# EasyEDA Pro project ProPrj_Keyboard_2025-12-19.epro

# Schematic Schematic1
Board Name: Board1; Create Date: 2025-12-10; Page Name: P1; Project Name: Keyboard; Schematic Name: Schematic1; Update Date: 2025-12-17; Company: BluePrint; Drawn: Saymon Islam; Page Size: A4; Version: V1.0
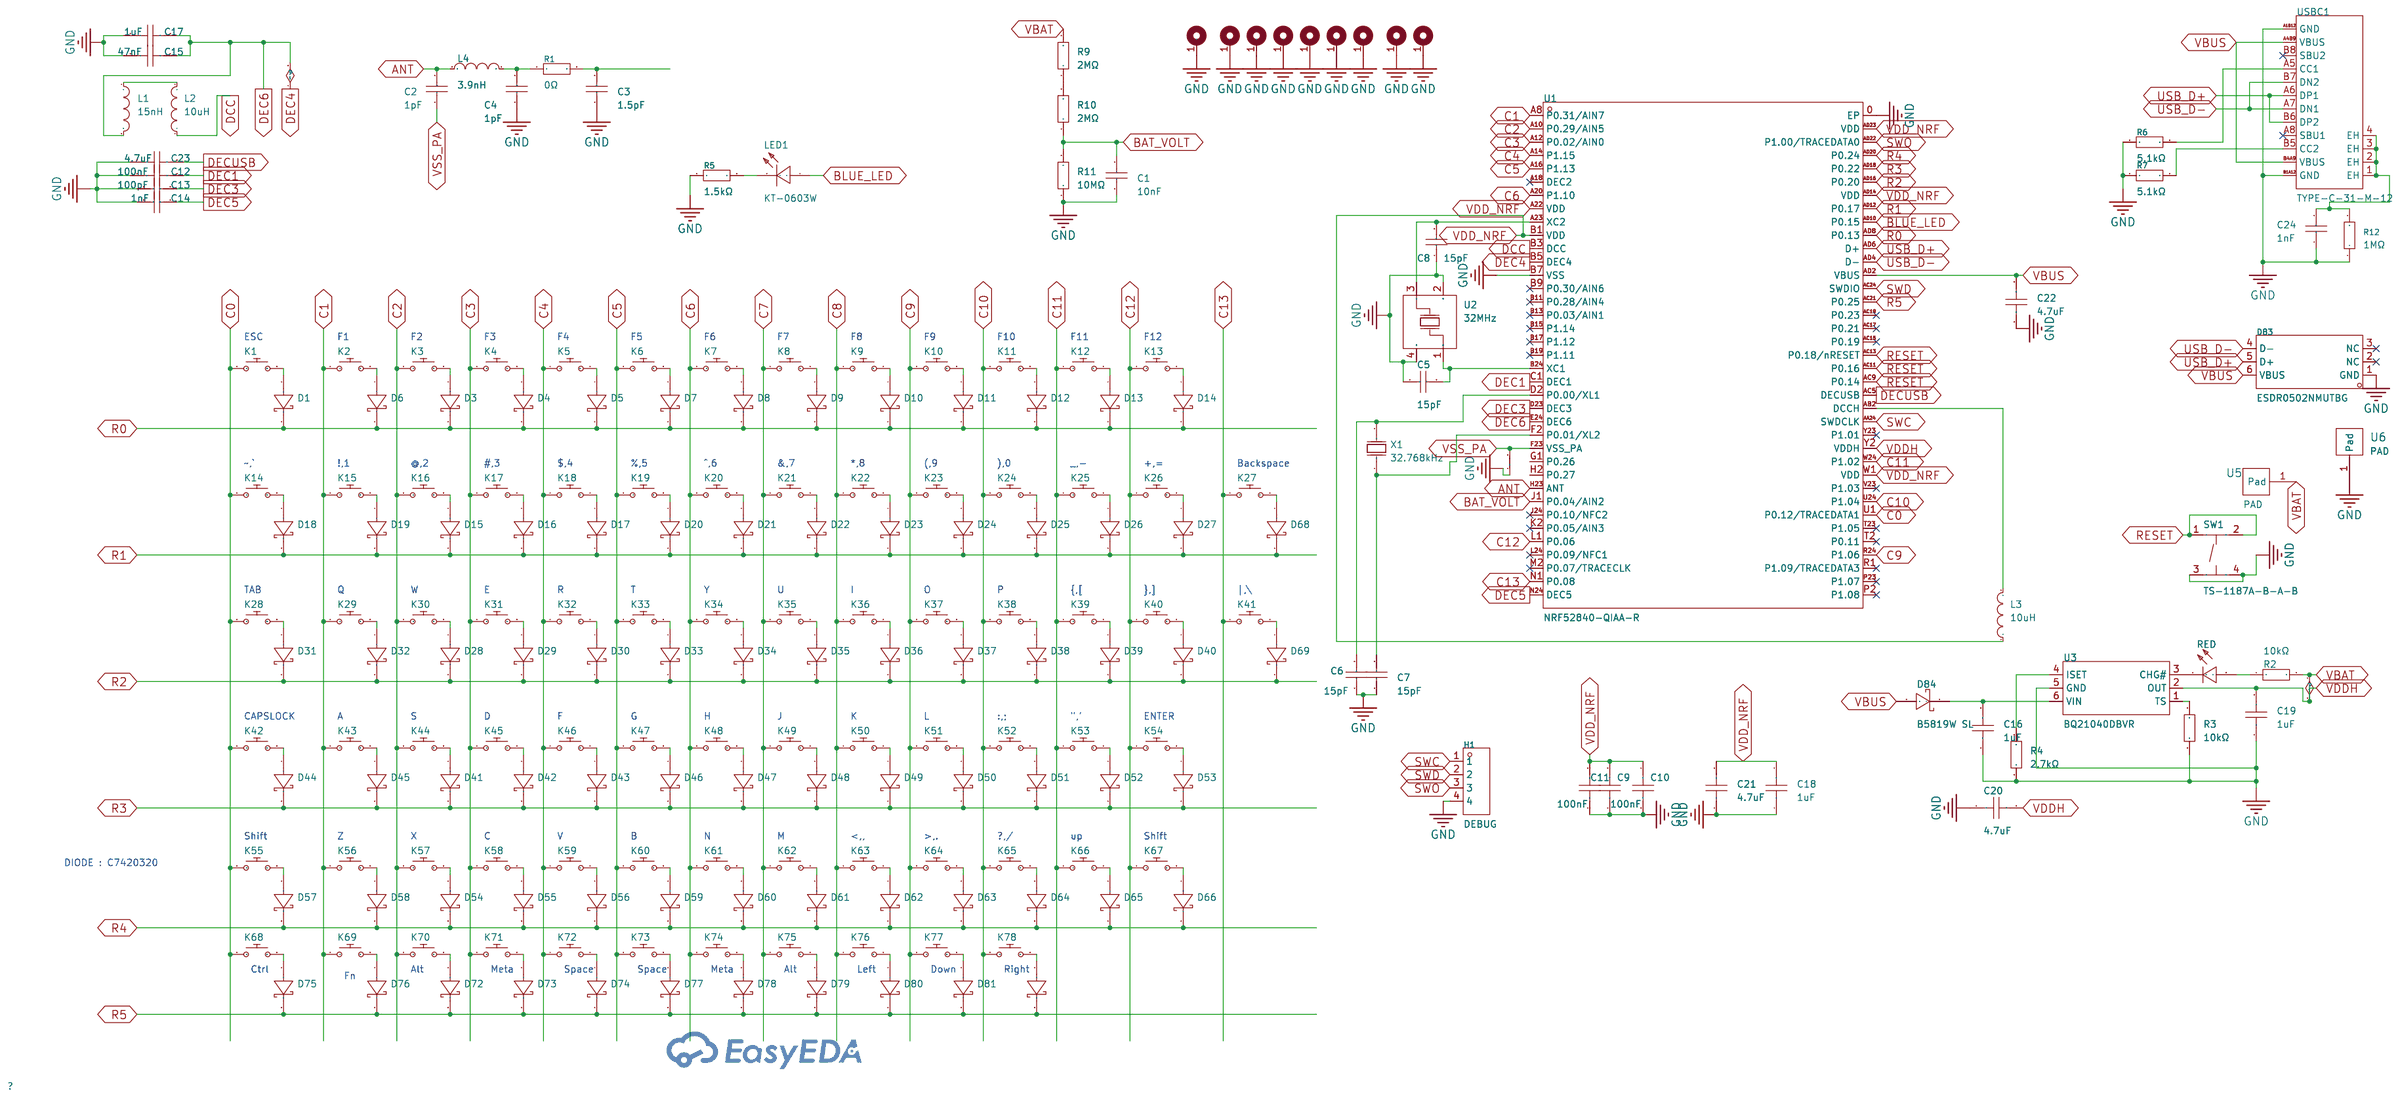
[diagram p0: schematic sheet]

## Parts
C1  10nF  [C0402]
C2  1pF  [C0402]
C3  1.5pF  [C0402]
C4  1pF  [C0402]
C5  15pF  [C0402]
C6  15pF  [C0402]
C7  15pF  [C0402]
C8  15pF  [C0402]
C9  100nF  [C0402]
C10  100nF  [C0402]
C11  100nF  [C0402]
C12  100nF  [C0402]
C13  100pF  [C0402]
C14  1nF  [C0402]
C15  47nF  [C0402]
C16  1uF  [C0402]
C17  1uF  [C0402]
C18  1uF  [C0402]
C19  1uF  [C0402]
C20  4.7uF  [C0402]
C21  4.7uF  [C0402]
C22  4.7uF  [C0402]
C23  4.7uF  [C0402]
C24  1nF  [C0402]
D1  1N4148WT  [SOD-523_L1.2-W0.8-LS1.6-FD]
D3  1N4148WT  [SOD-523_L1.2-W0.8-LS1.6-FD]
D4  1N4148WT  [SOD-523_L1.2-W0.8-LS1.6-FD]
D5  1N4148WT  [SOD-523_L1.2-W0.8-LS1.6-FD]
D6  1N4148WT  [SOD-523_L1.2-W0.8-LS1.6-FD]
D7  1N4148WT  [SOD-523_L1.2-W0.8-LS1.6-FD]
D8  1N4148WT  [SOD-523_L1.2-W0.8-LS1.6-FD]
D9  1N4148WT  [SOD-523_L1.2-W0.8-LS1.6-FD]
D10  1N4148WT  [SOD-523_L1.2-W0.8-LS1.6-FD]
D11  1N4148WT  [SOD-523_L1.2-W0.8-LS1.6-FD]
D12  1N4148WT  [SOD-523_L1.2-W0.8-LS1.6-FD]
D13  1N4148WT  [SOD-523_L1.2-W0.8-LS1.6-FD]
D14  1N4148WT  [SOD-523_L1.2-W0.8-LS1.6-FD]
D15  1N4148WT  [SOD-523_L1.2-W0.8-LS1.6-FD]
D16  1N4148WT  [SOD-523_L1.2-W0.8-LS1.6-FD]
D17  1N4148WT  [SOD-523_L1.2-W0.8-LS1.6-FD]
D18  1N4148WT  [SOD-523_L1.2-W0.8-LS1.6-FD]
D19  1N4148WT  [SOD-523_L1.2-W0.8-LS1.6-FD]
D20  1N4148WT  [SOD-523_L1.2-W0.8-LS1.6-FD]
D21  1N4148WT  [SOD-523_L1.2-W0.8-LS1.6-FD]
D22  1N4148WT  [SOD-523_L1.2-W0.8-LS1.6-FD]
D23  1N4148WT  [SOD-523_L1.2-W0.8-LS1.6-FD]
D24  1N4148WT  [SOD-523_L1.2-W0.8-LS1.6-FD]
D25  1N4148WT  [SOD-523_L1.2-W0.8-LS1.6-FD]
D26  1N4148WT  [SOD-523_L1.2-W0.8-LS1.6-FD]
D27  1N4148WT  [SOD-523_L1.2-W0.8-LS1.6-FD]
D28  1N4148WT  [SOD-523_L1.2-W0.8-LS1.6-FD]
D29  1N4148WT  [SOD-523_L1.2-W0.8-LS1.6-FD]
D30  1N4148WT  [SOD-523_L1.2-W0.8-LS1.6-FD]
D31  1N4148WT  [SOD-523_L1.2-W0.8-LS1.6-FD]
D32  1N4148WT  [SOD-523_L1.2-W0.8-LS1.6-FD]
D33  1N4148WT  [SOD-523_L1.2-W0.8-LS1.6-FD]
D34  1N4148WT  [SOD-523_L1.2-W0.8-LS1.6-FD]
D35  1N4148WT  [SOD-523_L1.2-W0.8-LS1.6-FD]
D36  1N4148WT  [SOD-523_L1.2-W0.8-LS1.6-FD]
D37  1N4148WT  [SOD-523_L1.2-W0.8-LS1.6-FD]
D38  1N4148WT  [SOD-523_L1.2-W0.8-LS1.6-FD]
D39  1N4148WT  [SOD-523_L1.2-W0.8-LS1.6-FD]
D40  1N4148WT  [SOD-523_L1.2-W0.8-LS1.6-FD]
D41  1N4148WT  [SOD-523_L1.2-W0.8-LS1.6-FD]
D42  1N4148WT  [SOD-523_L1.2-W0.8-LS1.6-FD]
D43  1N4148WT  [SOD-523_L1.2-W0.8-LS1.6-FD]
D44  1N4148WT  [SOD-523_L1.2-W0.8-LS1.6-FD]
D45  1N4148WT  [SOD-523_L1.2-W0.8-LS1.6-FD]
D46  1N4148WT  [SOD-523_L1.2-W0.8-LS1.6-FD]
D47  1N4148WT  [SOD-523_L1.2-W0.8-LS1.6-FD]
D48  1N4148WT  [SOD-523_L1.2-W0.8-LS1.6-FD]
D49  1N4148WT  [SOD-523_L1.2-W0.8-LS1.6-FD]
D50  1N4148WT  [SOD-523_L1.2-W0.8-LS1.6-FD]
D51  1N4148WT  [SOD-523_L1.2-W0.8-LS1.6-FD]
D52  1N4148WT  [SOD-523_L1.2-W0.8-LS1.6-FD]
D53  1N4148WT  [SOD-523_L1.2-W0.8-LS1.6-FD]
D54  1N4148WT  [SOD-523_L1.2-W0.8-LS1.6-FD]
D55  1N4148WT  [SOD-523_L1.2-W0.8-LS1.6-FD]
D56  1N4148WT  [SOD-523_L1.2-W0.8-LS1.6-FD]
D57  1N4148WT  [SOD-523_L1.2-W0.8-LS1.6-FD]
D58  1N4148WT  [SOD-523_L1.2-W0.8-LS1.6-FD]
D59  1N4148WT  [SOD-523_L1.2-W0.8-LS1.6-FD]
D60  1N4148WT  [SOD-523_L1.2-W0.8-LS1.6-FD]
D61  1N4148WT  [SOD-523_L1.2-W0.8-LS1.6-FD]
D62  1N4148WT  [SOD-523_L1.2-W0.8-LS1.6-FD]
D63  1N4148WT  [SOD-523_L1.2-W0.8-LS1.6-FD]
D64  1N4148WT  [SOD-523_L1.2-W0.8-LS1.6-FD]
D65  1N4148WT  [SOD-523_L1.2-W0.8-LS1.6-FD]
D66  1N4148WT  [SOD-523_L1.2-W0.8-LS1.6-FD]
D68  1N4148WT  [SOD-523_L1.2-W0.8-LS1.6-FD]
D69  1N4148WT  [SOD-523_L1.2-W0.8-LS1.6-FD]
D72  1N4148WT  [SOD-523_L1.2-W0.8-LS1.6-FD]
D73  1N4148WT  [SOD-523_L1.2-W0.8-LS1.6-FD]
D74  1N4148WT  [SOD-523_L1.2-W0.8-LS1.6-FD]
D75  1N4148WT  [SOD-523_L1.2-W0.8-LS1.6-FD]
D76  1N4148WT  [SOD-523_L1.2-W0.8-LS1.6-FD]
D77  1N4148WT  [SOD-523_L1.2-W0.8-LS1.6-FD]
D78  1N4148WT  [SOD-523_L1.2-W0.8-LS1.6-FD]
D79  1N4148WT  [SOD-523_L1.2-W0.8-LS1.6-FD]
D80  1N4148WT  [SOD-523_L1.2-W0.8-LS1.6-FD]
D81  1N4148WT  [SOD-523_L1.2-W0.8-LS1.6-FD]
D82  1N4148WT  [SOD-523_L1.2-W0.8-LS1.6-FD]
D83  ESDR0502NMUTBG  [UDFN-6_L1.2-W1.0-P0.40-BL]
D84  B5819W SL  [SOD-123_L2.7-W1.6-LS3.7-RD-1]
H1  DEBUG  [HDR-TH_4P-P2.54-V-F]
H2  -  [M2_KB]
H3  -  [M2_KB]
H4  -  [M2_KB]
H5  -  [M2_KB]
H6  -  [M2_KB]
H7  -  [M2_KB]
H8  -  [M2_KB]
H9  -  [M2_KB]
H10  -  [M2_KB]
K1  -  [Cherry_ULP_SMD FT]
K2  -  [Cherry_ULP_SMD FT]
K3  -  [Cherry_ULP_SMD FT]
K4  -  [Cherry_ULP_SMD FT]
K5  -  [Cherry_ULP_SMD FT]
K6  -  [Cherry_ULP_SMD FT]
K7  -  [Cherry_ULP_SMD FT]
K8  -  [Cherry_ULP_SMD FT]
K9  -  [Cherry_ULP_SMD FT]
K10  -  [Cherry_ULP_SMD FT]
K11  -  [Cherry_ULP_SMD FT]
K12  -  [Cherry_ULP_SMD FT]
K13  -  [Cherry_ULP_SMD FT]
K14  -  [Cherry_ULP_SMD FT]
K15  -  [Cherry_ULP_SMD FT]
K16  -  [Cherry_ULP_SMD FT]
K17  -  [Cherry_ULP_SMD FT]
K18  -  [Cherry_ULP_SMD FT]
K19  -  [Cherry_ULP_SMD FT]
K20  -  [Cherry_ULP_SMD FT]
K21  -  [Cherry_ULP_SMD FT]
K22  -  [Cherry_ULP_SMD FT]
K23  -  [Cherry_ULP_SMD FT]
K24  -  [Cherry_ULP_SMD FT]
K25  -  [Cherry_ULP_SMD FT]
K26  -  [Cherry_ULP_SMD FT]
K27  -  [Cherry_ULP_SMD FT]
K28  -  [Cherry_ULP_SMD FT]
K29  -  [Cherry_ULP_SMD FT]
K30  -  [Cherry_ULP_SMD FT]
K31  -  [Cherry_ULP_SMD FT]
K32  -  [Cherry_ULP_SMD FT]
K33  -  [Cherry_ULP_SMD FT]
K34  -  [Cherry_ULP_SMD FT]
K35  -  [Cherry_ULP_SMD FT]
K36  -  [Cherry_ULP_SMD FT]
K37  -  [Cherry_ULP_SMD FT]
K38  -  [Cherry_ULP_SMD FT]
K39  -  [Cherry_ULP_SMD FT]
K40  -  [Cherry_ULP_SMD FT]
K41  -  [Cherry_ULP_SMD FT]
K42  -  [Cherry_ULP_SMD FT]
K43  -  [Cherry_ULP_SMD FT]
K44  -  [Cherry_ULP_SMD FT]
K45  -  [Cherry_ULP_SMD FT]
K46  -  [Cherry_ULP_SMD FT]
K47  -  [Cherry_ULP_SMD FT]
K48  -  [Cherry_ULP_SMD FT]
K49  -  [Cherry_ULP_SMD FT]
K50  -  [Cherry_ULP_SMD FT]
K51  -  [Cherry_ULP_SMD FT]
K52  -  [Cherry_ULP_SMD FT]
K53  -  [Cherry_ULP_SMD FT]
K54  -  [Cherry_ULP_SMD FT]
K55  -  [Cherry_ULP_SMD FT]
K56  -  [Cherry_ULP_SMD FT]
K57  -  [Cherry_ULP_SMD FT]
K58  -  [Cherry_ULP_SMD FT]
K59  -  [Cherry_ULP_SMD FT]
K60  -  [Cherry_ULP_SMD FT]
K61  -  [Cherry_ULP_SMD FT]
K62  -  [Cherry_ULP_SMD FT]
K63  -  [Cherry_ULP_SMD FT]
K64  -  [Cherry_ULP_SMD FT]
K65  -  [Cherry_ULP_SMD FT]
K66  -  [Cherry_ULP_SMD FT]
K67  -  [Cherry_ULP_SMD FT]
K68  -  [Cherry_ULP_SMD FT]
K69  -  [Cherry_ULP_SMD FT]
K70  -  [Cherry_ULP_SMD FT]
K71  -  [Cherry_ULP_SMD FT]
K72  -  [Cherry_ULP_SMD FT]
K73  -  [Cherry_ULP_SMD FT]
K74  -  [Cherry_ULP_SMD FT]
K75  -  [Cherry_ULP_SMD FT]
K76  -  [Cherry_ULP_SMD FT]
K77  -  [Cherry_ULP_SMD FT]
K78  -  [Cherry_ULP_SMD FT]
L1  15nH  [L0402]
L2  10uH  [L0603]
L3  10uH  [L0603]
L4  3.9nH  [L0402]
LED1  KT-0603W  [LED0603-R-RD_WHITE]
R1  0Ω  [R0402]
R2  10kΩ  [R0402]
R3  10kΩ  [R0402]
R4  2.7kΩ  [R0603]
R5  1.5kΩ  [R0402]
R6  5.1kΩ  [R0402]
R7  5.1kΩ  [R0402]
R9  2MΩ  [R0603]
R10  2MΩ  [R0603]
R11  10MΩ  [R0402]
R12  1MΩ  [R0402]
RED  19-213/Y2C-CQ2R2L/3T(CY)  [LED0603-RD-YELLOW]
SW1  TS-1187A-B-A-B  [SW-SMD_4P-L5.1-W5.1-P3.70-LS6.5-TL_H1.5]
U1  NRF52840-QIAA-R  [AQFN-73_L7.0-W7.0-P0.50-BL-EP4.8]
U2  32MHz  [CRYSTAL-SMD_4P-L2.0-W1.6-BL-2]
U3  BQ21040DBVR  [SOT-23-6_L2.9-W1.6-P0.95-LS2.8-BR]
U4  -  [net-tie-2-0.3mm ft]
U5  PAD  [PADPAD]
U6  PAD  [PADPAD]
USBC1  TYPE-C-31-M-12  [USB-C_SMD-TYPE-C-31-M-12_1]
X1  32.768kHz  [FC-12M_L2.0-W1.2]

## Library data of the parts
C1 = CL05B103KB5NNNC: Capacitance:10nF Tolerance:±10% Tolerance:±10% Voltage Rating:50V Temperature Coefficient:X7R; LCSC Part Name: 10nF ±10% 50V; Supplier Part: C15195; Manufacturer: SAMSUNG(三星); Supplier Footprint: 0402; JLCPCB Part Class: Basic Part; Datasheet: https://item.szlcsc.com/datasheet/CL05B103KB5NNNC/15869.html; Supplier: LCSC; Tolerance: ±10%; Voltage Rating: 50V; Temperature Coefficient: X7R
C2 C4 = 0402CG1R0C500NT: Capacitance:1pF Voltage Rating:50V Temperature Coefficient:C0G; LCSC Part Name: ±0.25pF 1pF 50V; Supplier Part: C1550; Manufacturer: FH(风华); Supplier Footprint: 0402; JLCPCB Part Class: Extended Part; Datasheet: https://item.szlcsc.com/datasheet/0402CG1R0C500NT/1902.html; Supplier: LCSC; Voltage Rating: 50V; Temperature Coefficient: C0G
C3 = 0402CG1R5C500NT: Capacitance:1.5pF Voltage Rating:50V Temperature Coefficient:C0G; LCSC Part Name: ±0.25pF 1.5pF 50V; Supplier Part: C1552; Manufacturer: FH(风华); Supplier Footprint: 0402; Datasheet: https://item.szlcsc.com/datasheet/0402CG1R5C500NT/1904.html; Supplier: LCSC; Voltage Rating: 50V; Temperature Coefficient: C0G
C5-C8 = 0402CG150J500NT: Capacitance:15pF Tolerance:±5% Tolerance:±5% Voltage Rating:50V Temperature Coefficient:C0G; LCSC Part Name: 15pF ±5% 50V; Supplier Part: C1548; Manufacturer: FH(风华); Supplier Footprint: 0402; Datasheet: https://item.szlcsc.com/datasheet/0402CG150J500NT/1900.html; Supplier: LCSC; Tolerance: ±5%; Voltage Rating: 50V; Temperature Coefficient: C0G
C9-C12 = CL05B104KB54PNC: Capacitance:100nF Tolerance:±10% Tolerance:±10% Voltage Rating:50V Temperature Coefficient:X7R; LCSC Part Name: 100nF ±10% 50V; Supplier Part: C307331; Manufacturer: SAMSUNG(三星); Supplier Footprint: 0402; Datasheet: https://item.szlcsc.com/datasheet/CL05B104KB54PNC/291005.html; Supplier: LCSC; Tolerance: ±10%; Voltage Rating: 50V; Temperature Coefficient: X7R
C13 = 0402CG101J500NT: Capacitance: Tolerance:±5% Tolerance:±5% Voltage Rated: Temperature Coefficient:; LCSC Part Name: 100pF ±5% 50V; Supplier Part: C1546; Manufacturer: FH(风华); Supplier Footprint: 0402; Datasheet: https://atta.szlcsc.com/upload/public/pdf/source/20200305/C486355_26A10D38EF8C2A5C37091D0039909270.pdf; Supplier: LCSC; Tolerance: ±5%
C14 C24 = 0402B102K500NT: Capacitance:1nF Tolerance:±10% Tolerance:±10% Voltage Rating:50V Temperature Coefficient:X7R; LCSC Part Name: 1nF ±10% 50V; Supplier Part: C1523; Manufacturer: FH(风华); Supplier Footprint: 0402; Datasheet: https://item.szlcsc.com/datasheet/0402B102K500NT/1875.html; Supplier: LCSC; Tolerance: ±10%; Voltage Rating: 50V; Temperature Coefficient: X7R
C15 = CC0402KRX7R9BB473: Capacitance:47nF Tolerance:±10% Tolerance:±10% Voltage Rating:50V Temperature Coefficient:X7R; LCSC Part Name: 47nF ±10% 50V; Supplier Part: C272875; Manufacturer: YAGEO(国巨); Supplier Footprint: 0402; Datasheet: https://item.szlcsc.com/datasheet/CC0402KRX7R9BB473/261267.html; Supplier: LCSC; Tolerance: ±10%; Voltage Rating: 50V; Temperature Coefficient: X7R
C16-C19 = CL05A105KA5NQNC: Capacitance:1uF Tolerance:±10% Tolerance:±10% Voltage Rating:25V Temperature Coefficient:X5R; LCSC Part Name: 1uF ±10% 25V; Supplier Part: C52923; Manufacturer: SAMSUNG(三星); Supplier Footprint: 0402; Datasheet: https://item.szlcsc.com/datasheet/CL05A105KA5NQNC/53938.html; Supplier: LCSC; Tolerance: ±10%; Voltage Rating: 25V; Temperature Coefficient: X5R
C20-C23 = CL05A475MP5NRNC: Capacitance:4.7uF Tolerance:±20% Tolerance:±20% Voltage Rating:10V Temperature Coefficient:X5R; LCSC Part Name: 4.7uF ±20% 10V; Supplier Part: C23733; Manufacturer: SAMSUNG(三星); Supplier Footprint: 0402; Datasheet: https://item.szlcsc.com/datasheet/CL05A475MP5NRNC/24469.html; Supplier: LCSC; Tolerance: ±20%; Voltage Rating: 10V; Temperature Coefficient: X5R
D1 D3-D66 D68 D69 D72-D82 = 1N4148WT_C7420320: Diode Configuration:Independent Voltage - Forward(Vf@If):1.25V@150mA Voltage - DC Reverse(Vr):100V Current - Rectified:150mA Pd - Power Dissipation:150mW Reverse Leakage Current (Ir):1uA@75V Reverse Recovery Time (trr):4ns Operating Junction Temperature R; Supplier Part: C7420320; Manufacturer: R+O(宏嘉诚); Supplier Footprint: SOD-523; Datasheet: https://item.szlcsc.com/datasheet/1N4148WT/8397142.html; Supplier: LCSC; Diode Configuration: Independent; Voltage - Forward(Vf@If): 1.25V@150mA; Voltage - DC Reverse(Vr): 100V; Current - Rectified: 150mA; Pd - Power Dissipation: 150mW; Reverse Leakage Current (Ir): 1uA@75V; Reverse Recovery Time (trr): 4ns; Operating Junction Temperature Range: -55℃~+150℃; Non-Repetitive Peak Forward Surge Current: 2A
D83 = ESDR0502NMUTBG: Polarity:Unidirectional Reverse Stand-Off Voltage (Vrwm):5.5V Peak Pulse Current (Ipp):3A Peak Pulse Power Dissipation (Ppp):100W@8/20us Voltage - Breakdown:6V Reverse Leakage Current (Ir):1uA Number of Channels:3.0 Operating Temperature:-40℃~+125℃ Operat; LCSC Part Name: 单向ESD; Supplier Part: C327480; Manufacturer: onsemi(安森美); Supplier Footprint: UDFN-6(1x1.2); Datasheet: https://item.szlcsc.com/datasheet/ESDR0502NMUTBG/307631.html; Supplier: LCSC; Polarity: Unidirectional; Reverse Stand-Off Voltage (Vrwm): 5.5V; Peak Pulse Current (Ipp): 3A; Peak Pulse Power Dissipation (Ppp): 100W@8/20us; Voltage - Breakdown: 6V; Reverse Leakage Current (Ir): 1uA; Number of Channels: 3.0; Operating Temperature: -40℃~+125℃; level of protection: IEC 61000-4-2; Type: ESD; Junction Capacitance: 0.3pF
D84 = B5819W SL: Voltage - Forward(Vf@If):600mV@1A Voltage - DC Reverse(Vr):40V Current - Rectified:1A Non-Repetitive Peak Forward Surge Current:9A; LCSC Part Name: 电压:40V 电流:1A; Supplier Part: C8598; Manufacturer: CJ(江苏长电/长晶); Supplier Footprint: SOD-123; Datasheet: https://item.szlcsc.com/datasheet/B5819W%2520SL/9093.html; Supplier: LCSC; Voltage - Forward(Vf@If): 600mV@1A; Voltage - DC Reverse(Vr): 40V; Current - Rectified: 1A; Non-Repetitive Peak Forward Surge Current: 9A
H1 = 2.54-1*4P母: Holes Structure:1x4P Pitch:2.54mm Row Spacing:- Circular Hole / Square Hole:Square Hole Mounting Type:Through Hole Number of Rows:1 Number of Positions:4P Current Rating:3A Voltage Rating (Max):- Holes Direction:Top Insulation Height:- Contact Material:Br; LCSC Part Name: 间距:2.54mm 1x4P 直插; Supplier Part: C2718488; Manufacturer: BOOMELE(博穆精密); Supplier Footprint: 插件,P=2.54mm; Datasheet: https://item.szlcsc.com/datasheet/2.54-1*4P%25E6%25AF%258D/2834502.html; Supplier: LCSC; Holes Structure: 1x4P; Pitch: 2.54mm; Circular Hole / Square Hole: Square Hole; Mounting Type: Through Hole; Number of Rows: 1; Number of Positions: 4P; Current Rating: 3A; Holes Direction: Top; Contact Material: Bronze; Operating Temperature: -40℃~+105℃
H2-H10 = M2_KB
K1-K78 = Cherry_ULP_SMD FT
L1 = SDCL1005C15NJTDF_C27143: Inductance: Tolerance:±5% Tolerance:±5% Rated Current: Current - Saturation (Isat):- DC Resistance(DCR): Q @ Frequency:8@100MHz Frequency - Self Resonant: Ratings:; LCSC Part Name: 15nH ±5%; Supplier Part: C27143; Manufacturer: Sunlord(顺络); Manufacturer Part: SDCL1005C15NJTDF; Supplier Footprint: 0402; Datasheet: https://atta.szlcsc.com/upload/public/pdf/source/20231027/6126A3AAC5912C34388756BE22DEE00C.pdf; Supplier: LCSC; Tolerance: ±5%; Q @ Frequency: 8@100MHz
L2 L3 = CPY160808T-100M-NP: Inductance:10uH Tolerance:±20% Tolerance:±20% Current Rating:90mA Current - Saturation (Isat):- DC Resistance(DCR):900mΩ Q @ Frequency:- Frequency - Self Resonant:- Ratings:-; LCSC Part Name: 10uH ±20%; Supplier Part: C285968; Manufacturer: Chilisin(奇力新); Supplier Footprint: 0603; Datasheet: https://item.szlcsc.com/datasheet/CPY160808T-100M-NP/271273.html; Supplier: LCSC; Tolerance: ±20%; Current Rating: 90mA; DC Resistance(DCR): 900mΩ
L4 = SDCL1005C3N9STDF: Inductance:3.9nH Tolerance:- Tolerance:- Current Rating:300mA Current - Saturation (Isat):- DC Resistance(DCR):200mΩ Q @ Frequency:8@100MHz Frequency - Self Resonant:4GHz Ratings:-; LCSC Part Name: ±0.3nH 3.9nH; Supplier Part: C14033; Manufacturer: Sunlord(顺络); Supplier Footprint: 0402; Datasheet: https://item.szlcsc.com/datasheet/SDCL1005C3N9STDF/14690.html; Supplier: LCSC; Current Rating: 300mA; DC Resistance(DCR): 200mΩ; Q @ Frequency: 8@100MHz; Frequency - Self Resonant: 4GHz
LED1 = KT-0603W: Illumination Color:White Voltage - Forward(Vf):2.6V~3.1V Voltage - Forward(Vf):2.6V~3.1V Power(Watts):100mW Forward Current:5mA Diode Configuration:Discrete Diode Lens Color:Yellow Lens Luminous Intensity:360mcd Luminous Intensity:360mcd Viewing Angle:120; LCSC Part Name: 0603 白灯 高亮; Supplier Part: C2290; Manufacturer: KENTO; Supplier Footprint: 0603; JLCPCB Part Class: Basic Part; Datasheet: https://item.szlcsc.com/datasheet/KT-0603W/2663.html; Supplier: LCSC; Illumination Color: White; Voltage - Forward(Vf): 2.6V~3.1V; Power(Watts): 100mW; Forward Current: 5mA; Diode Configuration: Discrete Diode; Lens Color: Yellow Lens; Luminous Intensity: 360mcd; Viewing Angle: 120°; Mounting Style: op View Mount
R1 = 0402WGF0000TCE: Type:Thick Film Resistor Resistance:0Ω Tolerance:±1% Tolerance:±1% Power(Watts):62.5mW Voltage-Supply(Max):50V Temperature Coefficient:±800ppm/℃ Temperature Coefficient:±800ppm/℃ Operating Temperature:-55℃~+155℃ Operating Temperature:-55℃~+155℃; LCSC Part Name: 0Ω ±1% 62.5mW 厚膜电阻; Supplier Part: C17168; Manufacturer: UNI-ROYAL(厚声); Supplier Footprint: 0402; JLCPCB Part Class: Basic Part; Datasheet: https://item.szlcsc.com/datasheet/0402WGF0000TCE/17853.html; Supplier: LCSC; Type: Thick Film Resistor; Tolerance: ±1%; Power(Watts): 62.5mW; Voltage-Supply(Max): 50V; Temperature Coefficient: ±800ppm/℃; Operating Temperature: -55℃~+155℃
R2 R3 = 0402WGF1002TCE: Type:Thick Film Resistor Resistance:10kΩ Tolerance:±1% Tolerance:±1% Power(Watts):62.5mW Voltage-Supply(Max):50V Temperature Coefficient:±100ppm/℃ Temperature Coefficient:±100ppm/℃ Operating Temperature:-55℃~+155℃ Operating Temperature:-55℃~+155℃; LCSC Part Name: 10kΩ ±1% 62.5mW 厚膜电阻; Supplier Part: C25744; Manufacturer: UNI-ROYAL(厚声); Supplier Footprint: 0402; Datasheet: https://item.szlcsc.com/datasheet/0402WGF1002TCE/26487.html; Supplier: LCSC; Type: Thick Film Resistor; Tolerance: ±1%; Power(Watts): 62.5mW; Voltage-Supply(Max): 50V; Temperature Coefficient: ±100ppm/℃; Operating Temperature: -55℃~+155℃
R4 = 0603WAF2701T5E: Type:Thick Film Resistor Resistance:2.7kΩ Tolerance:±1% Tolerance:±1% Power(Watts):100mW Voltage-Supply(Max):75V Temperature Coefficient:±100ppm/℃ Temperature Coefficient:±100ppm/℃ Operating Temperature:-55℃~+155℃ Operating Temperature:-55℃~+155℃; LCSC Part Name: 2.7kΩ ±1% 100mW 厚膜电阻; Supplier Part: C13167; Manufacturer: UNI-ROYAL(厚声); Supplier Footprint: 0603; Datasheet: https://item.szlcsc.com/datasheet/0603WAF2701T5E/13814.html; Supplier: LCSC; Type: Thick Film Resistor; Tolerance: ±1%; Power(Watts): 100mW; Voltage-Supply(Max): 75V; Temperature Coefficient: ±100ppm/℃; Operating Temperature: -55℃~+155℃
R5 = 0402WGF1501TCE: Type:Thick Film Resistors Resistance:1.5kΩ Tolerance:±1% Tolerance:±1% Power(Watts): Overload Voltage (Max): Temperature Coefficient:±100ppm/℃ Temperature Coefficient:±100ppm/℃ Operating Temperature Range:-55℃~+155℃ Operating Temperature Range:-55℃~+155℃; LCSC Part Name: 1.5kΩ ±1% 62.5mW 厚膜电阻; Supplier Part: C25867; Manufacturer: UNI-ROYAL(厚声); Supplier Footprint: 0402; Datasheet: https://atta.szlcsc.com/upload/public/pdf/source/20200306/C422600_1E6D84923E4A46A82E41ADD87F860B5C.pdf; Supplier: LCSC; Type: Thick Film Resistors; Tolerance: ±1%; Temperature Coefficient: ±100ppm/℃; Operating Temperature Range: -55℃~+155℃
R6 R7 = 0402WGF5101TCE: Type:Thick Film Resistor Resistance:5.1kΩ Tolerance:±1% Tolerance:±1% Power(Watts):62.5mW Voltage-Supply(Max):50V Temperature Coefficient:±100ppm/℃ Temperature Coefficient:±100ppm/℃ Operating Temperature:-55℃~+155℃ Operating Temperature:-55℃~+155℃; LCSC Part Name: 5.1kΩ ±1% 62.5mW 厚膜电阻; Supplier Part: C25905; Manufacturer: UNI-ROYAL(厚声); Supplier Footprint: 0402; JLCPCB Part Class: Basic Part; Datasheet: https://item.szlcsc.com/datasheet/0402WGF5101TCE/26648.html; Supplier: LCSC; Type: Thick Film Resistor; Tolerance: ±1%; Power(Watts): 62.5mW; Voltage-Supply(Max): 50V; Temperature Coefficient: ±100ppm/℃; Operating Temperature: -55℃~+155℃
R9 R10 = 0603WAF2004T5E: Type:Thick Film Resistor Resistance:2MΩ Tolerance:±1% Tolerance:±1% Power(Watts):100mW Voltage-Supply(Max):75V Temperature Coefficient:±100ppm/℃ Temperature Coefficient:±100ppm/℃ Operating Temperature:-55℃~+155℃ Operating Temperature:-55℃~+155℃; LCSC Part Name: 2MΩ ±1% 100mW 厚膜电阻; Supplier Part: C22976; Manufacturer: UNI-ROYAL(厚声); Supplier Footprint: 0603; Datasheet: https://item.szlcsc.com/datasheet/0603WAF2004T5E/23703.html; Supplier: LCSC; Type: Thick Film Resistor; Tolerance: ±1%; Power(Watts): 100mW; Voltage-Supply(Max): 75V; Temperature Coefficient: ±100ppm/℃; Operating Temperature: -55℃~+155℃
R11 = 0402WGF1005TCE: Type:Thick Film Resistor Resistance:10MΩ Tolerance:±1% Tolerance:±1% Power(Watts):62.5mW Voltage-Supply(Max):50V Temperature Coefficient:±200ppm/℃ Temperature Coefficient:±200ppm/℃ Operating Temperature:-55℃~+155℃ Operating Temperature:-55℃~+155℃; LCSC Part Name: 10MΩ ±1% 62.5mW 厚膜电阻; Supplier Part: C26082; Manufacturer: UNI-ROYAL(厚声); Supplier Footprint: 0402; JLCPCB Part Class: Extended Part; Datasheet: https://item.szlcsc.com/datasheet/0402WGF1005TCE/26825.html; Supplier: LCSC; Type: Thick Film Resistor; Tolerance: ±1%; Power(Watts): 62.5mW; Voltage-Supply(Max): 50V; Temperature Coefficient: ±200ppm/℃; Operating Temperature: -55℃~+155℃
R12 = 0402WGF1004TCE: Type:Thick Film Resistor Resistance:1MΩ Tolerance:±1% Tolerance:±1% Power(Watts):62.5mW Voltage-Supply(Max):50V Temperature Coefficient:±100ppm/℃ Temperature Coefficient:±100ppm/℃ Operating Temperature:-55℃~+155℃ Operating Temperature:-55℃~+155℃; LCSC Part Name: 1MΩ ±1% 62.5mW 厚膜电阻; Supplier Part: C26083; Manufacturer: UNI-ROYAL(厚声); Supplier Footprint: 0402; Datasheet: https://item.szlcsc.com/datasheet/0402WGF1004TCE/26826.html; Supplier: LCSC; Type: Thick Film Resistor; Tolerance: ±1%; Power(Watts): 62.5mW; Voltage-Supply(Max): 50V; Temperature Coefficient: ±100ppm/℃; Operating Temperature: -55℃~+155℃
RED = 19-213/Y2C-CQ2R2L/3T(CY): Illumination Color:Yellow Power(Watts):60mW Forward Current:20mA Wavelength - Dominant:585.5nm~591.5nm Wavelength - Dominant:585.5nm~591.5nm Peak Wavelength:591nm Diode Configuration:- Lens Color:Water Clear Color Temperature:- Color Temperature:- Viewing; LCSC Part Name: 黄灯; Supplier Part: C72038; Manufacturer: EVERLIGHT(亿光); Supplier Footprint: 0603; Supplier: LCSC; Illumination Color: Yellow; Power(Watts): 60mW; Forward Current: 20mA; Wavelength - Dominant: 585.5nm~591.5nm; Peak Wavelength: 591nm; Lens Color: Water Clear; Viewing Angle: 120°; Operating Temperature: -40℃~+85℃
SW1 = TS-1187A-B-A-B: Circuit:SPST Actuator Style:Round Button Operating Force:1.6N Mounting Type:Surface Mount,Vertical Length:5.1mm Width:5.1mm Switch Height:1.5mm with Bracket:Without Bracket Contact Current:50mA Voltage Rating:12V Actuator/Cap Color:Gold With Lamp:No Life:; LCSC Part Name: 5.1*5.1*1.5mm 立贴 轻触开关; Supplier Part: C318884; Manufacturer: XKB Connection(中国星坤); Supplier Footprint: SMD; Datasheet: https://item.szlcsc.com/datasheet/TS-1187A-B-A-B/299976.html; Supplier: LCSC; Circuit: SPST; Actuator Style: Round Button; Operating Force: 1.6N; Mounting Type: Surface Mount,Vertical; Length: 5.1mm; Width: 5.1mm; Switch Height: 1.5mm; with Bracket: Without Bracket; Contact Current: 50mA; Voltage Rating: 12V; Actuator/Cap Color: Gold; With Lamp: No; Life: 100,000 Cycles; Operating Temperature: -30℃~+85℃
U1 = NRF52840-QIAA-R: Frequency Range:2.4GHz~2.4835GHz Frequency Range:2.4GHz~2.4835GHz Interface:ADC；SPI；PWM；I2S；USB；UART Voltage - Supply:1.7V~5.5V Voltage - Supply:1.7V~5.5V Applications:ISM；Bluetooth；ZigBee；IoT；LoRa Output Power:8dBm Data Rate:2Mbps Current Of Transmitting; LCSC Part Name: 蓝牙，IEEE 802.15.4-2006，2.4GHz收发器; Supplier Part: C190794; Manufacturer: NORDIC; Supplier Footprint: AQFN-73-EP(7x7); Datasheet: https://item.szlcsc.com/datasheet/NRF52840-QIAA-R/213038.html; Supplier: LCSC; Frequency Range: 2.4GHz~2.4835GHz; Interface: ADC；SPI；PWM；I2S；USB；UART; Voltage - Supply: 1.7V~5.5V; Applications: ISM；Bluetooth；ZigBee；IoT；LoRa; Output Power: 8dBm; Data Rate: 2Mbps; Current Of Transmitting: 4.82mA; Sensitivity: -95dBm; Receive Current: 6.26mA; Typical Application Frequency: 2.4GHz; Type: transceiver
U2 = XL7EL89COI-111YLC-32M: Type:Crystal Oscillator Frequency:32MHz Normal temperature Frequency Tolerance:±10ppm Normal temperature Frequency Tolerance:±10ppm Load Capacitance:12pF Frequency Stability:±20ppm Frequency Stability:±20ppm Equivalent Series Resistance(ESR):- Operating T; LCSC Part Name: YSX211SL 32MHZ 4P 2016 12PF ±10PPM -40~85℃ (±20PPM); Supplier Part: C2965584; Manufacturer: YXC(扬兴晶振); Supplier Footprint: SMD2016-4P; Datasheet: https://item.szlcsc.com/datasheet/XL7EL89COI-111YLC-32M/3357720.html; Supplier: LCSC; Type: Crystal Oscillator; Normal temperature Frequency Tolerance: ±10ppm; Load Capacitance: 12pF; Frequency Stability: ±20ppm; Operating Temperature: -40℃~+85℃
U3 = BQ21040DBVR: The Chip Type:Charging IC Voltage - Supply:3.5V~28V Voltage - Supply:3.5V~28V Charge Current - Max:800mA Charging Saturation Voltage:4.2V Type of Battery:- Number of Cells:1 Number of Cells:1 Operating Temperature:0℃~+125℃ Operating Temperature:0℃~+125℃ B; LCSC Part Name: 单输入、单节锂离子和锂聚合物电池充电器; Supplier Part: C202311; Manufacturer: TI(德州仪器); Supplier Footprint: SOT-23-6; Datasheet: https://www.ti.com/cn/lit/gpn/bq21040; Supplier: LCSC; The Chip Type: Charging IC; Voltage - Supply: 3.5V~28V; Charge Current - Max: 800mA; Charging Saturation Voltage: 4.2V; Number of Cells: 1; Operating Temperature: 0℃~+125℃; Battery Temperature Detection: Support; Supply Current (Iq): 125uA
U4 = net-tie-2-0.3mm ft
U5 U6 = PAD
USBC1 = TYPE-C-31-M-12: Connector Type:Type-C Protocol Standard:- Gender:Female Mounting Type:- Number of Contacts:16P Number of Ports:1 Current Rating-Power:5A Operating Temperature:- Operating Temperature:-; LCSC Part Name: Type-C 母; Supplier Part: C165948; Manufacturer: 韩国韩荣; Supplier Footprint: SMD; Datasheet: https://item.szlcsc.com/datasheet/TYPE-C-31-M-12/177331.html; Supplier: LCSC; Connector Type: Type-C; Gender: Female; Number of Contacts: 16P; Number of Ports: 1; Current Rating-Power: 5A
X1 = X1A0000610006: Type:Crystal Oscillator Frequency:32.768kHz Normal temperature Frequency Tolerance:±20ppm Normal temperature Frequency Tolerance:±20ppm Load Capacitance:7pF Equivalent Series Resistance(ESR):90kΩ Operating Temperature:-40℃~+85℃ Operating Temperature:-40℃~; LCSC Part Name: 32.768kHz ±20ppm 7pF; Supplier Part: C99009; Manufacturer: EPSON(爱普生); Supplier Footprint: SMD2012-2P; Datasheet: https://item.szlcsc.com/datasheet/X1A0000610006/100221.html; Supplier: LCSC; Type: Crystal Oscillator; Normal temperature Frequency Tolerance: ±20ppm; Load Capacitance: 7pF; Equivalent Series Resistance(ESR): 90kΩ; Operating Temperature: -40℃~+85℃

## Nets
GND: C1.1 C3.1 C4.1 C5.1 C6.1 C7.1 C8.1 C9.1 C10.2 C11.1 C12.1 C13.1 C14.1 C15.2 C16.1 C17.1 C18.1 C19.1 C20.1 C21.1 C22.1 C23.1 C24.1 D83.1(GND) H1.4 H2.1 H3.1 H4.1 H5.1 H6.1 H7.1 H8.1 H9.1 H10.1 R3.1 R4.1 R5.1 R6.1 R7.1 R11.1 R12.1 SW1.3(C) SW1.4(D) U1.0(EP) U1.B7(VSS) U2.2(GND) U2.4(GND) U3.5(GND) U4.1 U6.1(Pad) USBC1.A1B12(GND) USBC1.B1A12(GND)
VBAT: C19.2 C20.2 R2.2 R9.2 U1.Y2(VDDH) U3.2(OUT) U5.1(Pad)
VBUS: C22.2 D83.6(VBUS) D84.2(+) U1.AD2(VBUS) USBC1.A4B9(VBUS) USBC1.B4A9(VBUS)
VDD_NRF: C9.2 C10.1 C11.2 C18.2 C21.2 L3.1 U1.A22(VDD) U1.AD14(VDD) U1.AD23(VDD) U1.B1(VDD) U1.W1(VDD)
VSS_PA: C2.1 U1.F23(VSS_PA) U4.2
ANT: C2.2 L4.1 U1.H23(ANT)
BAT_VOLT: C1.2 R10.1 R11.2 U1.J1(P0.04/AIN2)
BLUE_LED: LED1.1(A) U1.AD10(P0.15)
C0: K1.1 K14.1 K28.1 K42.1 K55.1 K68.1 U1.U1(P0.12/TRACEDATA1)
C1: K2.1 K15.1 K29.1 K43.1 K56.1 K69.1 U1.A8(P0.31/AIN7)
C2: K3.1 K16.1 K30.1 K44.1 K57.1 K70.1 U1.A10(P0.29/AIN5)
C3: K4.1 K17.1 K31.1 K45.1 K58.1 K71.1 U1.A12(P0.02/AIN0)
C4: K5.1 K18.1 K32.1 K46.1 K59.1 K72.1 U1.A14(P1.15)
C5: K6.1 K19.1 K33.1 K47.1 K60.1 K73.1 U1.A16(P1.13)
C6: K7.1 K20.1 K34.1 K48.1 K61.1 K74.1 U1.A20(P1.10)
C7: K8.1 K21.1 K35.1 K49.1 K62.1 K75.1
C8: K9.1 K22.1 K36.1 K50.1 K63.1 K76.1
C9: K10.1 K23.1 K37.1 K51.1 K64.1 K77.1 U1.R24(P1.06)
C10: K11.1 K24.1 K38.1 K52.1 K65.1 K78.1 U1.U24(P1.04)
C11: K12.1 K25.1 K39.1 K53.1 K66.1 U1.W24(P1.02)
C12: K13.1 K26.1 K40.1 K54.1 K67.1 U1.L1(P0.06)
C13: K27.1 K41.1 U1.N1(P0.08)
DCC: L2.1 U1.B3(DCC)
DEC1: C12.2 U1.C1(DEC1)
DEC3: C13.2 U1.D23(DEC3)
DEC4: C15.1 C17.2 L1.2 U1.B5(DEC4) U1.E24(DEC6)
DEC5: C14.2 U1.N24(DEC5)
DECUSB: C23.2 U1.AC5(DECUSB)
R0: D1.2(K) D3.2(K) D4.2(K) D5.2(K) D6.2(K) D7.2(K) D8.2(K) D9.2(K) D10.2(K) D11.2(K) D12.2(K) D13.2(K) D14.2(K) U1.AD8(P0.13)
R1: D15.2(K) D16.2(K) D17.2(K) D18.2(K) D19.2(K) D20.2(K) D21.2(K) D22.2(K) D23.2(K) D24.2(K) D25.2(K) D26.2(K) D27.2(K) D68.2(K) U1.AD12(P0.17)
R2: D28.2(K) D29.2(K) D30.2(K) D31.2(K) D32.2(K) D33.2(K) D34.2(K) D35.2(K) D36.2(K) D37.2(K) D38.2(K) D39.2(K) D40.2(K) D69.2(K) U1.AD16(P0.20)
R3: D41.2(K) D42.2(K) D43.2(K) D44.2(K) D45.2(K) D46.2(K) D47.2(K) D48.2(K) D49.2(K) D50.2(K) D51.2(K) D52.2(K) D53.2(K) U1.AD18(P0.22)
R4: D54.2(K) D55.2(K) D56.2(K) D57.2(K) D58.2(K) D59.2(K) D60.2(K) D61.2(K) D62.2(K) D63.2(K) D64.2(K) D65.2(K) D66.2(K) U1.AD20(P0.24)
R5: D72.2(K) D73.2(K) D74.2(K) D75.2(K) D76.2(K) D77.2(K) D78.2(K) D79.2(K) D80.2(K) D81.2(K) D82.2(K) U1.AC21(P0.25)
RESET: SW1.1(A) SW1.2(B) U1.AC9(P0.14) U1.AC11(P0.16) U1.AC13(P0.18/nRESET)
SWC: H1.1 U1.AA24(SWDCLK)
SWD: H1.2 U1.AC24(SWDIO)
SWO: H1.3 U1.AD22(P1.00/TRACEDATA0)
USB_D+: D83.5(D+) U1.AD6(D+) USBC1.A6(DP1) USBC1.B6(DP2)
USB_D-: D83.4(D-) U1.AD4(D-) USBC1.A7(DN1) USBC1.B7(DN2)
$1N9452: D3.1(A) K3.2
$1N9524: D4.1(A) K4.2
$1N9597: D5.1(A) K5.2
$1N9671: D1.1(A) K1.2
$1N9738: D6.1(A) K2.2
$1N9818: D7.1(A) K6.2
$1N9893: D8.1(A) K7.2
$1N9969: D9.1(A) K8.2
$1N10046: D10.1(A) K9.2
$1N10124: D11.1(A) K10.2
$1N10203: D12.1(A) K11.2
$1N10283: D13.1(A) K12.2
$1N10364: D14.1(A) K13.2
$1N12325: D15.1(A) K16.2
$1N12330: D16.1(A) K17.2
$1N12335: D17.1(A) K18.2
$1N12340: D18.1(A) K14.2
$1N12345: D19.1(A) K15.2
$1N12350: D20.1(A) K19.2
$1N12355: D21.1(A) K20.2
$1N12360: D22.1(A) K21.2
$1N12365: D23.1(A) K22.2
$1N12370: D24.1(A) K23.2
$1N12375: D25.1(A) K24.2
$1N12380: D26.1(A) K25.2
$1N12385: D27.1(A) K26.2
$1N13263: D28.1(A) K30.2
$1N13268: D29.1(A) K31.2
$1N13273: D30.1(A) K32.2
$1N13278: D31.1(A) K28.2
$1N13283: D32.1(A) K29.2
$1N13288: D33.1(A) K33.2
$1N13293: D34.1(A) K34.2
$1N13298: D35.1(A) K35.2
$1N13303: D36.1(A) K36.2
$1N13308: D37.1(A) K37.2
$1N13313: D38.1(A) K38.2
$1N13318: D39.1(A) K39.2
$1N13323: D40.1(A) K40.2
$1N14214: D41.1(A) K44.2
$1N14219: D42.1(A) K45.2
$1N14224: D43.1(A) K46.2
$1N14229: D44.1(A) K42.2
$1N14234: D45.1(A) K43.2
$1N14239: D46.1(A) K47.2
$1N14244: D47.1(A) K48.2
$1N14249: D48.1(A) K49.2
$1N14254: D49.1(A) K50.2
$1N14259: D50.1(A) K51.2
$1N14264: D51.1(A) K52.2
$1N14269: D52.1(A) K53.2
$1N14274: D53.1(A) K54.2
$1N15178: D54.1(A) K57.2
$1N15183: D55.1(A) K58.2
$1N15188: D56.1(A) K59.2
$1N15193: D57.1(A) K55.2
$1N15198: D58.1(A) K56.2
$1N15203: D59.1(A) K60.2
$1N15208: D60.1(A) K61.2
$1N15213: D61.1(A) K62.2
$1N15218: D62.1(A) K63.2
$1N15223: D63.1(A) K64.2
$1N15228: D64.1(A) K65.2
$1N15233: D65.1(A) K66.2
$1N15238: D66.1(A) K67.2
$1N16120: D68.1(A) K27.2
$1N16124: D69.1(A) K41.2
$1N18490: D72.1(A) K70.2
$1N18492: D73.1(A) K71.2
$1N18494: D74.1(A) K72.2
$1N18496: D75.1(A) K68.2
$1N18498: D76.1(A) K69.2
$1N18500: D77.1(A) K73.2
$1N18502: D78.1(A) K74.2
$1N18504: D79.1(A) K75.2
$1N18506: D80.1(A) K76.2
$1N18508: D81.1(A) K77.2
$1N18510: D82.1(A) K78.2
$1N22276: C24.2 R12.2 USBC1.1(EH) USBC1.2(EH) USBC1.3(EH) USBC1.4(EH)
$1N22597: R6.2 USBC1.A5(CC1)
$1N22606: R7.2 USBC1.B5(CC2)
$1N22694: RED.1(C) U3.3(CHG#)
$1N22700: R2.1 RED.2(A)
$1N22853: R3.2 U3.1(TS)
$1N22932: R4.2 U3.4(ISET)
$1N22952: C16.2 D84.1(-) U3.6(VIN)
$1N23249: R9.1 R10.2
$1N23540: C5.2 U1.B24(XC1) U2.1(OSC1)
$1N23569: C8.2 U1.A23(XC2) U2.3(OSC2)
$1N24215: L1.1 L2.2
$1N24338: L3.2 U1.AB2(DCCH)
$1N24425: C6.2 U1.D2(P0.00/XL1) X1.2(OSC2)
$1N24434: C7.2 U1.F2(P0.01/XL2) X1.1(OSC1)
$1N24900: C4.2 L4.2 R1.1
$1N24939: LED1.2(K) R5.2
$1N24943: C3.2 R1.2

Not connected (* = marked no-connect by the designer): D83 2(NC)* 3(NC)*; U1 A18(DEC2)* AC15(P0.19)* AC17(P0.21)* AC19(P0.23)* B9(P0.30/AIN6)* B11(P0.28/AIN4)* B13(P0.03/AIN1)* B15(P1.14)* B17(P1.12)* B19(P1.11)* G1(P0.26) H2(P0.27) J24(P0.10/NFC2)* K2(P0.05/AIN3)* L24(P0.09/NFC1)* M2(P0.07/TRACECLK)* P2(P1.08)* P23(P1.07)* R1(P1.09/TRACEDATA3)* T2(P0.11)* T23(P1.05)* V23(P1.03)* Y23(P1.01)*; USBC1 A8(SBU1)* B8(SBU2)*

## Notes on the sheet
- ESC
- F1
- F2
- F3
- F4
- F5
- F6
- F7
- F8
- F9
- F10
- F11
- F12
- ~,`
- !,1
- @,2
- #,3
- $,4
- %,5
- ^,6
- &,7
- *,8
- (,9
- ),0
- _,-
- +,=
- Backspace
- TAB
- Q
- W
- E
- R
- T
- Y
- U
- I
- O
- P
- {,[
- },]
- |,\
- CAPSLOCK
- A
- S
- D
- F
- G
- H
- J
- K
- L
- :,;
- ",'
- ENTER
- Shift
- Z
- X
- C
- V
- B
- N
- M
- <,,
- >,.
- ?,/
- up
- Shift
- DIODE : C7420320
- Ctrl
- Fn
- Alt
- Meta
- Space
- Space
- Meta
- Alt
- Left
- Down
- Right

# Board PCB1
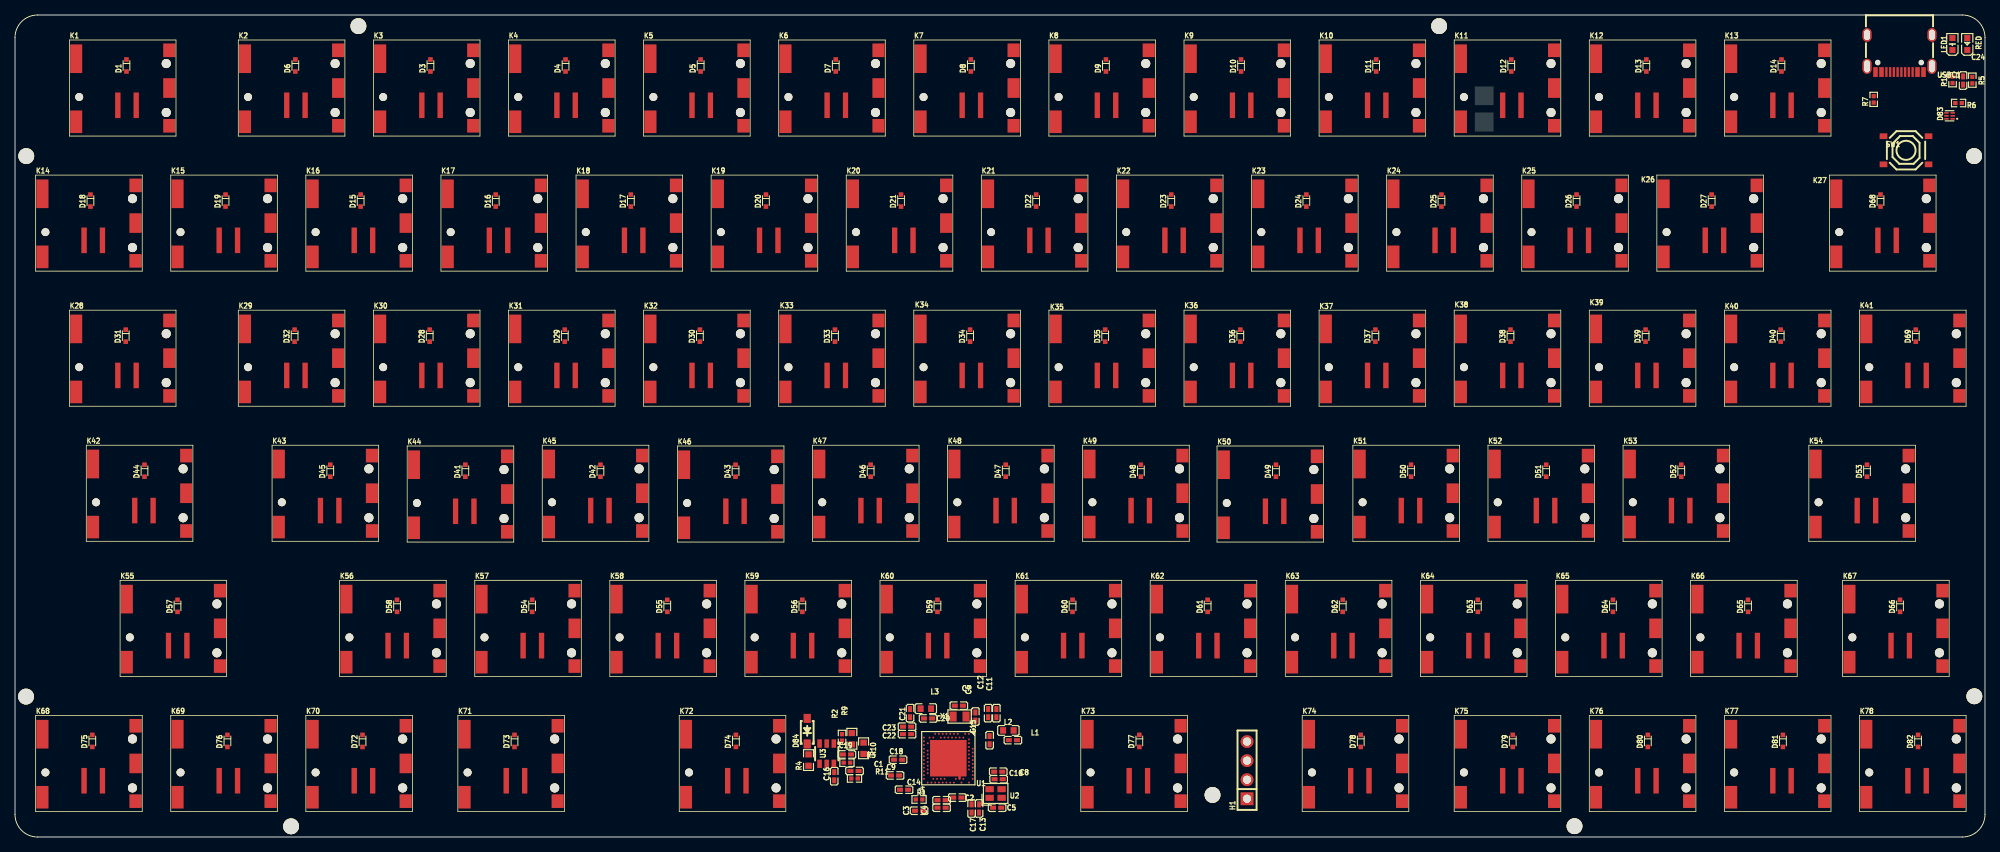
[diagram p1: board, top side]
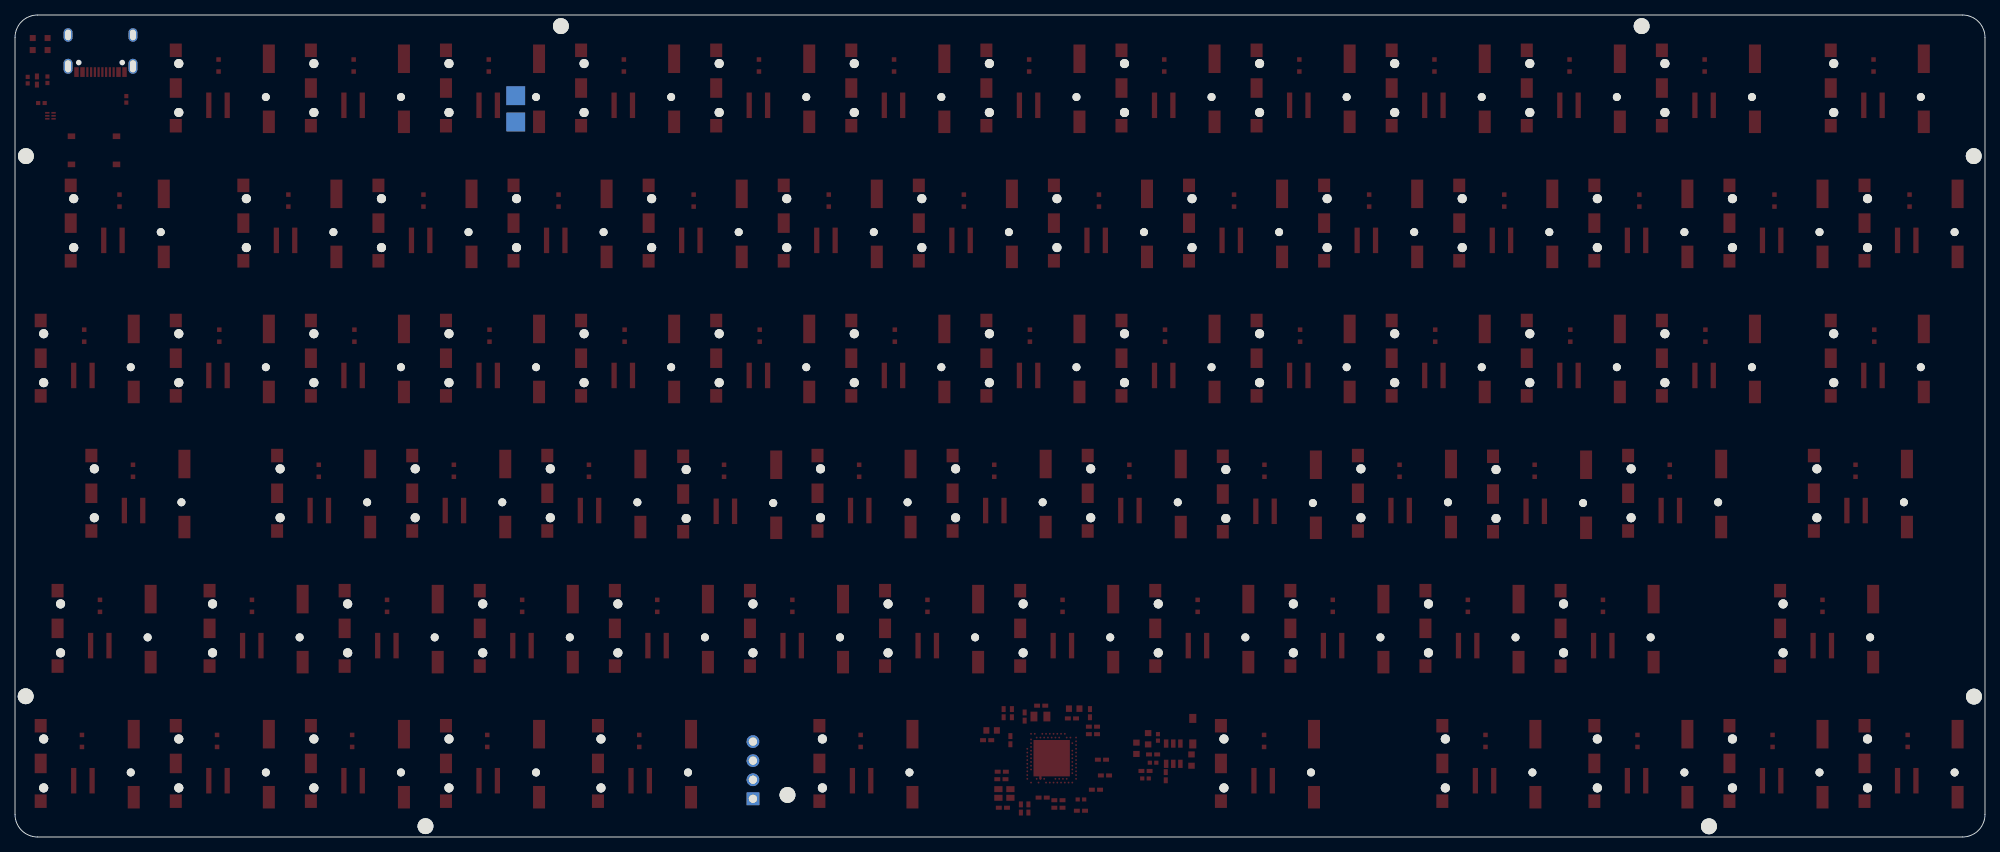
[diagram p2: board, bottom side, seen from below]

Outline 262.47 x 109.53 mm; copper layers: Top Layer, Bottom Layer. Coordinates in mm from the lower left corner of the outline.
Outline path: 0,106.53 0,3 arc(0.88,0.88) 3,0 259.47,0 arc(261.59,0.88) 262.47,3 262.47,106.53 arc(261.59,108.65) 259.47,109.53 3,109.53 arc(0.88,108.65) 0,106.53
Stack: Top Layer 0.035mm / Dielectric1 1.51mm FR4 er 4.5 / Bottom Layer 0.035mm

## Design rules (mm)
net USB_D-: DP1
net USB_D+: DP1
template: JLCPCB Capability(Two Layers Board)
spacing copperThickness1oz (default): track to track 0.102, other pairs 0.152 to 0.3
spacing copperThickness2oz: track to track 0.203, other pairs 0.152 to 0.3
track width copperThickness1oz (default): min 0.127, default 0.254, max 2.54
track width copperThickness2oz: min 0.203, default 0.254, max 2.54
differential pair differentialPair (default): width min 0.127, default 0.254, max 2.54; gap min 0.152, default 0.152
via viaSize (default): diameter min 0.5, default 0.61, max 10; hole min 0.3, default 0.305, max 6.3

## Placement (name value [footprint] x y rotation side)
C1  10nF  [C0402]  111.85 8.8 180 top
C2  1pF  [C0402]  125.55 5.25 180 top
C3  1.5pF  [C0402]  120.45 3.5 180 top
C4  1pF  [C0402]  123.45 3.9 180 top
C5  15pF  [C0402]  130.85 3.9 180 top
C6  15pF  [C0402]  127.95 16.05 270 top
C7  15pF  [C0402]  125.75 17.5 180 top
C8  15pF  [C0402]  131.05 7.7 180 top
C9  100nF  [C0402]  117.25 8.2 0 top
C10  100nF  [C0402]  131 8.7 0 top
C11  100nF  [C0402]  130.75 16.5 270 top
C12  100nF  [C0402]  129.65 16.5 270 top
C13  100pF  [C0402]  128.45 3.8 90 top
C14  1nF  [C0402]  118.45 6.3 0 top
C15  47nF  [C0402]  129.85 12.9 270 top
C16  1uF  [C0402]  109.15 8.1 90 top
C17  1uF  [C0402]  127.45 3.8 90 top
C18  1uF  [C0402]  117.65 10.3 0 top
C19  1uF  [C0402]  110.84 11 180 top
C20  4.7uF  [C0402]  121.65 15.8 180 top
C21  4.7uF  [C0402]  119.25 16.5 90 top
C22  4.7uF  [C0402]  118.85 13.7 0 top
C23  4.7uF  [C0402]  118.85 14.7 0 top
C24  1nF  [C0402]  259.55 100.8 90 top
D1  1N4148WT  [SOD-523_L1.2-W0.8-LS1.6-FD]  14.85 102.8 90 top
D3  1N4148WT  [SOD-523_L1.2-W0.8-LS1.6-FD]  55.35 102.8 90 top
D4  1N4148WT  [SOD-523_L1.2-W0.8-LS1.6-FD]  73.35 102.8 90 top
D5  1N4148WT  [SOD-523_L1.2-W0.8-LS1.6-FD]  91.35 102.8 90 top
D6  1N4148WT  [SOD-523_L1.2-W0.8-LS1.6-FD]  37.35 102.8 90 top
D7  1N4148WT  [SOD-523_L1.2-W0.8-LS1.6-FD]  109.35 102.8 90 top
D8  1N4148WT  [SOD-523_L1.2-W0.8-LS1.6-FD]  127.35 102.8 90 top
D9  1N4148WT  [SOD-523_L1.2-W0.8-LS1.6-FD]  145.35 102.8 90 top
D10  1N4148WT  [SOD-523_L1.2-W0.8-LS1.6-FD]  163.35 102.8 90 top
D11  1N4148WT  [SOD-523_L1.2-W0.8-LS1.6-FD]  181.35 102.8 90 top
D12  1N4148WT  [SOD-523_L1.2-W0.8-LS1.6-FD]  199.35 102.8 90 top
D13  1N4148WT  [SOD-523_L1.2-W0.8-LS1.6-FD]  217.35 102.8 90 top
D14  1N4148WT  [SOD-523_L1.2-W0.8-LS1.6-FD]  235.35 102.8 90 top
D15  1N4148WT  [SOD-523_L1.2-W0.8-LS1.6-FD]  46.05 84.8 90 top
D16  1N4148WT  [SOD-523_L1.2-W0.8-LS1.6-FD]  64.05 84.8 90 top
D17  1N4148WT  [SOD-523_L1.2-W0.8-LS1.6-FD]  82.05 84.8 90 top
D18  1N4148WT  [SOD-523_L1.2-W0.8-LS1.6-FD]  10.05 84.8 90 top
D19  1N4148WT  [SOD-523_L1.2-W0.8-LS1.6-FD]  28.05 84.8 90 top
D20  1N4148WT  [SOD-523_L1.2-W0.8-LS1.6-FD]  100.05 84.8 90 top
D21  1N4148WT  [SOD-523_L1.2-W0.8-LS1.6-FD]  118.05 84.8 90 top
D22  1N4148WT  [SOD-523_L1.2-W0.8-LS1.6-FD]  136.05 84.8 90 top
D23  1N4148WT  [SOD-523_L1.2-W0.8-LS1.6-FD]  154.05 84.8 90 top
D24  1N4148WT  [SOD-523_L1.2-W0.8-LS1.6-FD]  172.05 84.8 90 top
D25  1N4148WT  [SOD-523_L1.2-W0.8-LS1.6-FD]  190.05 84.8 90 top
D26  1N4148WT  [SOD-523_L1.2-W0.8-LS1.6-FD]  208.05 84.8 90 top
D27  1N4148WT  [SOD-523_L1.2-W0.8-LS1.6-FD]  226.05 84.8 90 top
D28  1N4148WT  [SOD-523_L1.2-W0.8-LS1.6-FD]  55.25 66.8 90 top
D29  1N4148WT  [SOD-523_L1.2-W0.8-LS1.6-FD]  73.25 66.8 90 top
D30  1N4148WT  [SOD-523_L1.2-W0.8-LS1.6-FD]  91.25 66.8 90 top
D31  1N4148WT  [SOD-523_L1.2-W0.8-LS1.6-FD]  14.75 66.8 90 top
D32  1N4148WT  [SOD-523_L1.2-W0.8-LS1.6-FD]  37.25 66.8 90 top
D33  1N4148WT  [SOD-523_L1.2-W0.8-LS1.6-FD]  109.25 66.8 90 top
D34  1N4148WT  [SOD-523_L1.2-W0.8-LS1.6-FD]  127.25 66.8 90 top
D35  1N4148WT  [SOD-523_L1.2-W0.8-LS1.6-FD]  145.25 66.8 90 top
D36  1N4148WT  [SOD-523_L1.2-W0.8-LS1.6-FD]  163.25 66.8 90 top
D37  1N4148WT  [SOD-523_L1.2-W0.8-LS1.6-FD]  181.25 66.8 90 top
D38  1N4148WT  [SOD-523_L1.2-W0.8-LS1.6-FD]  199.25 66.8 90 top
D39  1N4148WT  [SOD-523_L1.2-W0.8-LS1.6-FD]  217.25 66.8 90 top
D40  1N4148WT  [SOD-523_L1.2-W0.8-LS1.6-FD]  235.25 66.8 90 top
D41  1N4148WT  [SOD-523_L1.2-W0.8-LS1.6-FD]  60 48.8 90 top
D42  1N4148WT  [SOD-523_L1.2-W0.8-LS1.6-FD]  78 48.8 90 top
D43  1N4148WT  [SOD-523_L1.2-W0.8-LS1.6-FD]  96 48.8 90 top
D44  1N4148WT  [SOD-523_L1.2-W0.8-LS1.6-FD]  17.25 48.8 90 top
D45  1N4148WT  [SOD-523_L1.2-W0.8-LS1.6-FD]  42 48.8 90 top
D46  1N4148WT  [SOD-523_L1.2-W0.8-LS1.6-FD]  114 48.8 90 top
D47  1N4148WT  [SOD-523_L1.2-W0.8-LS1.6-FD]  132 48.8 90 top
D48  1N4148WT  [SOD-523_L1.2-W0.8-LS1.6-FD]  150 48.8 90 top
D49  1N4148WT  [SOD-523_L1.2-W0.8-LS1.6-FD]  168 48.8 90 top
D50  1N4148WT  [SOD-523_L1.2-W0.8-LS1.6-FD]  186 48.8 90 top
D51  1N4148WT  [SOD-523_L1.2-W0.8-LS1.6-FD]  204 48.8 90 top
D52  1N4148WT  [SOD-523_L1.2-W0.8-LS1.6-FD]  222 48.8 90 top
D53  1N4148WT  [SOD-523_L1.2-W0.8-LS1.6-FD]  246.75 48.8 90 top
D54  1N4148WT  [SOD-523_L1.2-W0.8-LS1.6-FD]  68.9 30.8 90 top
D55  1N4148WT  [SOD-523_L1.2-W0.8-LS1.6-FD]  86.9 30.8 90 top
D56  1N4148WT  [SOD-523_L1.2-W0.8-LS1.6-FD]  104.9 30.8 90 top
D57  1N4148WT  [SOD-523_L1.2-W0.8-LS1.6-FD]  21.65 30.8 90 top
D58  1N4148WT  [SOD-523_L1.2-W0.8-LS1.6-FD]  50.9 30.8 90 top
D59  1N4148WT  [SOD-523_L1.2-W0.8-LS1.6-FD]  122.9 30.8 90 top
D60  1N4148WT  [SOD-523_L1.2-W0.8-LS1.6-FD]  140.9 30.8 90 top
D61  1N4148WT  [SOD-523_L1.2-W0.8-LS1.6-FD]  158.9 30.8 90 top
D62  1N4148WT  [SOD-523_L1.2-W0.8-LS1.6-FD]  176.9 30.8 90 top
D63  1N4148WT  [SOD-523_L1.2-W0.8-LS1.6-FD]  194.9 30.8 90 top
D64  1N4148WT  [SOD-523_L1.2-W0.8-LS1.6-FD]  212.9 30.8 90 top
D65  1N4148WT  [SOD-523_L1.2-W0.8-LS1.6-FD]  230.9 30.8 90 top
D66  1N4148WT  [SOD-523_L1.2-W0.8-LS1.6-FD]  251.15 30.8 90 top
D68  1N4148WT  [SOD-523_L1.2-W0.8-LS1.6-FD]  248.55 84.8 90 top
D69  1N4148WT  [SOD-523_L1.2-W0.8-LS1.6-FD]  253.25 66.8 90 top
D72  1N4148WT  [SOD-523_L1.2-W0.8-LS1.6-FD]  46.3 12.8 90 top
D73  1N4148WT  [SOD-523_L1.2-W0.8-LS1.6-FD]  66.55 12.8 90 top
D74  1N4148WT  [SOD-523_L1.2-W0.8-LS1.6-FD]  96.05 12.8 90 top
D75  1N4148WT  [SOD-523_L1.2-W0.8-LS1.6-FD]  10.3 12.8 90 top
D76  1N4148WT  [SOD-523_L1.2-W0.8-LS1.6-FD]  28.3 12.8 90 top
D77  1N4148WT  [SOD-523_L1.2-W0.8-LS1.6-FD]  149.8 12.8 90 top
D78  1N4148WT  [SOD-523_L1.2-W0.8-LS1.6-FD]  179.3 12.8 90 top
D79  1N4148WT  [SOD-523_L1.2-W0.8-LS1.6-FD]  199.55 12.8 90 top
D80  1N4148WT  [SOD-523_L1.2-W0.8-LS1.6-FD]  217.55 12.8 90 top
D81  1N4148WT  [SOD-523_L1.2-W0.8-LS1.6-FD]  235.55 12.8 90 top
D82  1N4148WT  [SOD-523_L1.2-W0.8-LS1.6-FD]  253.55 12.8 90 top
D83  ESDR0502NMUTBG  [UDFN-6_L1.2-W1.0-P0.40-BL]  257.75 96.1 90 top
D84  B5819W SL  [SOD-123_L2.7-W1.6-LS3.7-RD-1]  105.55 14.1 90 top
H1  DEBUG  [HDR-TH_4P-P2.54-V-F]  164.15 8.9 90 top
H2  -  [M2_KB]  261.02 90.73 0 top
H3  -  [M2_KB]  261.05 18.75 0 top
H4  -  [M2_KB]  207.78 1.44 0 top
H5  -  [M2_KB]  159.55 5.6 0 top
H6  -  [M2_KB]  36.78 1.42 0 top
H7  -  [M2_KB]  1.47 18.71 0 top
H8  -  [M2_KB]  1.5 90.73 0 top
H9  -  [M2_KB]  45.75 108.05 0 top
H10  -  [M2_KB]  189.74 108.05 0 top
K1  -  [Cherry_ULP_SMD FT]  14.35 99.8 0 top
K2  -  [Cherry_ULP_SMD FT]  36.85 99.8 0 top
K3  -  [Cherry_ULP_SMD FT]  54.85 99.8 0 top
K4  -  [Cherry_ULP_SMD FT]  72.85 99.8 0 top
K5  -  [Cherry_ULP_SMD FT]  90.85 99.8 0 top
K6  -  [Cherry_ULP_SMD FT]  108.85 99.8 0 top
K7  -  [Cherry_ULP_SMD FT]  126.85 99.8 0 top
K8  -  [Cherry_ULP_SMD FT]  144.85 99.8 0 top
K9  -  [Cherry_ULP_SMD FT]  162.85 99.8 0 top
K10  -  [Cherry_ULP_SMD FT]  180.85 99.8 0 top
K11  -  [Cherry_ULP_SMD FT]  198.85 99.8 0 top
K12  -  [Cherry_ULP_SMD FT]  216.85 99.8 0 top
K13  -  [Cherry_ULP_SMD FT]  234.85 99.8 0 top
K14  -  [Cherry_ULP_SMD FT]  9.85 81.8 0 top
K15  -  [Cherry_ULP_SMD FT]  27.85 81.8 0 top
K16  -  [Cherry_ULP_SMD FT]  45.85 81.8 0 top
K17  -  [Cherry_ULP_SMD FT]  63.85 81.8 0 top
K18  -  [Cherry_ULP_SMD FT]  81.85 81.8 0 top
K19  -  [Cherry_ULP_SMD FT]  99.85 81.8 0 top
K20  -  [Cherry_ULP_SMD FT]  117.85 81.8 0 top
K21  -  [Cherry_ULP_SMD FT]  135.85 81.8 0 top
K22  -  [Cherry_ULP_SMD FT]  153.85 81.8 0 top
K23  -  [Cherry_ULP_SMD FT]  171.85 81.8 0 top
K24  -  [Cherry_ULP_SMD FT]  189.85 81.8 0 top
K25  -  [Cherry_ULP_SMD FT]  207.85 81.8 0 top
K26  -  [Cherry_ULP_SMD FT]  225.85 81.8 0 top
K27  -  [Cherry_ULP_SMD FT]  248.85 81.8 0 top
K28  -  [Cherry_ULP_SMD FT]  14.35 63.8 0 top
K29  -  [Cherry_ULP_SMD FT]  36.85 63.8 0 top
K30  -  [Cherry_ULP_SMD FT]  54.85 63.8 0 top
K31  -  [Cherry_ULP_SMD FT]  72.85 63.8 0 top
K32  -  [Cherry_ULP_SMD FT]  90.85 63.8 0 top
K33  -  [Cherry_ULP_SMD FT]  108.85 63.8 0 top
K34  -  [Cherry_ULP_SMD FT]  126.85 63.8 0 top
K35  -  [Cherry_ULP_SMD FT]  144.85 63.8 0 top
K36  -  [Cherry_ULP_SMD FT]  162.85 63.8 0 top
K37  -  [Cherry_ULP_SMD FT]  180.85 63.8 0 top
K38  -  [Cherry_ULP_SMD FT]  198.85 63.8 0 top
K39  -  [Cherry_ULP_SMD FT]  216.85 63.8 0 top
K40  -  [Cherry_ULP_SMD FT]  234.85 63.8 0 top
K41  -  [Cherry_ULP_SMD FT]  252.85 63.8 0 top
K42  -  [Cherry_ULP_SMD FT]  16.6 45.8 0 top
K43  -  [Cherry_ULP_SMD FT]  41.35 45.8 0 top
K44  -  [Cherry_ULP_SMD FT]  59.35 45.7 0 top
K45  -  [Cherry_ULP_SMD FT]  77.35 45.8 0 top
K46  -  [Cherry_ULP_SMD FT]  95.35 45.7 0 top
K47  -  [Cherry_ULP_SMD FT]  113.35 45.8 0 top
K48  -  [Cherry_ULP_SMD FT]  131.35 45.8 0 top
K49  -  [Cherry_ULP_SMD FT]  149.35 45.8 0 top
K50  -  [Cherry_ULP_SMD FT]  167.25 45.7 0 top
K51  -  [Cherry_ULP_SMD FT]  185.35 45.8 0 top
K52  -  [Cherry_ULP_SMD FT]  203.35 45.8 0 top
K53  -  [Cherry_ULP_SMD FT]  221.35 45.8 0 top
K54  -  [Cherry_ULP_SMD FT]  246.1 45.8 0 top
K55  -  [Cherry_ULP_SMD FT]  21.1 27.8 0 top
K56  -  [Cherry_ULP_SMD FT]  50.35 27.8 0 top
K57  -  [Cherry_ULP_SMD FT]  68.35 27.8 0 top
K58  -  [Cherry_ULP_SMD FT]  86.35 27.8 0 top
K59  -  [Cherry_ULP_SMD FT]  104.35 27.8 0 top
K60  -  [Cherry_ULP_SMD FT]  122.35 27.8 0 top
K61  -  [Cherry_ULP_SMD FT]  140.35 27.8 0 top
K62  -  [Cherry_ULP_SMD FT]  158.35 27.8 0 top
K63  -  [Cherry_ULP_SMD FT]  176.35 27.8 0 top
K64  -  [Cherry_ULP_SMD FT]  194.35 27.8 0 top
K65  -  [Cherry_ULP_SMD FT]  212.35 27.8 0 top
K66  -  [Cherry_ULP_SMD FT]  230.35 27.8 0 top
K67  -  [Cherry_ULP_SMD FT]  250.6 27.8 0 top
K68  -  [Cherry_ULP_SMD FT]  9.85 9.8 0 top
K69  -  [Cherry_ULP_SMD FT]  27.85 9.8 0 top
K70  -  [Cherry_ULP_SMD FT]  45.85 9.8 0 top
K71  -  [Cherry_ULP_SMD FT]  66.1 9.8 0 top
K72  -  [Cherry_ULP_SMD FT]  95.6 9.8 0 top
K73  -  [Cherry_ULP_SMD FT]  149.1 9.8 0 top
K74  -  [Cherry_ULP_SMD FT]  178.6 9.8 0 top
K75  -  [Cherry_ULP_SMD FT]  198.85 9.8 0 top
K76  -  [Cherry_ULP_SMD FT]  216.85 9.8 0 top
K77  -  [Cherry_ULP_SMD FT]  234.85 9.8 0 top
K78  -  [Cherry_ULP_SMD FT]  252.85 9.8 0 top
L1  15nH  [L0402]  132.95 12.9 180 top
L2  10uH  [L0603]  132.35 14.2 0 top
L3  10uH  [L0603]  121.35 17.1 180 top
L4  3.9nH  [L0402]  123.45 4.9 180 top
LED1  KT-0603W  [LED0603-R-RD_WHITE]  258.13 105.66 90 top
R1  0Ω  [R0402]  120.45 5 180 top
R2  10kΩ  [R0402]  110.19 13.27 270 top
R3  10kΩ  [R0402]  110.84 9.9 180 top
R4  2.7kΩ  [R0603]  105.72 10.25 90 top
R5  1.5kΩ  [R0402]  260.78 100.85 90 top
R6  5.1kΩ  [R0402]  258.95 97.8 180 top
R7  5.1kΩ  [R0402]  247.64 98.29 90 top
R9  2MΩ  [R0603]  111.5 13.09 270 top
R10  2MΩ  [R0603]  113.06 11.82 90 top
R11  10MΩ  [R0402]  111.85 7.8 180 top
R12  1MΩ  [R0402]  258.15 100.9 90 top
RED  19-213/Y2C-CQ2R2L/3T(CY)  [LED0603-RD-YELLOW]  260.11 105.66 90 top
SW1  TS-1187A-B-A-B  [SW-SMD_4P-L5.1-W5.1-P3.70-LS6.5-TL_H1.5]  251.95 91.5 180 top
U1  NRF52840-QIAA-R  [AQFN-73_L7.0-W7.0-P0.50-BL-EP4.8]  124.35 10.5 180 top
U2  32MHz  [CRYSTAL-SMD_4P-L2.0-W1.6-BL-2]  130.65 5.8 0 top
U3  BQ21040DBVR  [SOT-23-6_L2.9-W1.6-P0.95-LS2.8-BR]  108.15 11.1 90 top
U4  -  [net-tie-2-0.3mm ft]  125.85 8.2 270 top
U5  PAD  [PADPAD]  195.75 98.9 180 bottom
U6  PAD  [PADPAD]  195.75 95.4 180 bottom
USBC1  TYPE-C-31-M-12  [USB-C_SMD-TYPE-C-31-M-12_1]  251.08 104.4 180 top
X1  32.768kHz  [FC-12M_L2.0-W1.2]  125.85 16.05 0 top

## Footprints (pads in the part's own frame, mm; a bottom-side part is the same pattern mirrored in y, then rotated)
AQFN-73_L7.0-W7.0-P0.50-BL-EP4.8
  rect 4.85x4.85 smd: 0(0,0)
  round 0.25 smd: A8(-3.25,-1.25) A10(-3.25,-0.75) A12(-3.25,-0.25) A14(-3.25,0.25) A16(-3.25,0.75) A18(-3.25,1.25) A20(-3.25,1.75) A22(-3.25,2.25) A23(-3.25,2.75) AA24(2.25,3.25) AB2(2.5,-2.75) AC5(2.75,-2) AC9(2.75,-1) AC11(2.75,-0.5) AC13(2.75,0) AC15(2.75,0.5) AC17(2.75,1) AC19(2.75,1.5) AC21(2.75,2) AC24(2.75,3.25) AD2(3.25,-2.75) AD4(3.25,-2.25) AD6(3.25,-1.75) AD8(3.25,-1.25) AD10(3.25,-0.75) AD12(3.25,-0.25) AD14(3.25,0.25) AD16(3.25,0.75) AD18(3.25,1.25) AD20(3.25,1.75) AD22(3.25,2.25) AD23(3.25,2.75) B1(-2.75,-3.25) B3(-2.75,-2.5) B5(-2.75,-2) B7(-2.75,-1.5) B9(-2.75,-1) B11(-2.75,-0.5) B13(-2.75,0) B15(-2.75,0.5) B17(-2.75,1) B19(-2.75,1.5) B24(-2.75,3.25) C1(-2.25,-3.25) D2(-2,-2.75) D23(-2,2.75) E24(-1.75,3.25) F2(-1.5,-2.75) F23(-1.5,2.75) G1(-1.25,-3.25) H2(-1,-2.75) H23(-1,2.75) J1(-0.75,-3.25) J24(-0.75,3.25) K2(-0.5,-2.75) L1(-0.25,-3.25) L24(-0.25,3.25) M2(0,-2.75) N1(0.25,-3.25) N24(0.25,3.25) P2(0.5,-2.75) P23(0.5,2.75) R1(0.75,-3.25) R24(0.75,3.25) T2(1,-2.75) T23(1,2.75) U1(1.25,-3.25) U24(1.25,3.25) V23(1.5,2.75) W1(1.75,-3.25) W24(1.75,3.25) Y2(2,-2.75) Y23(2,2.75)
C0402
  rect 0.79x0.54 smd: 1(-0.545,0) 2(0.545,0)
Cherry_ULP_SMD FT
  round 1.05 hole 1.05: (-5.8,-1.2)
  round 1.2 hole 1.2: (5.8,3.26) (5.8,-3.26)
  rect 0.7x3.4 smd: 1(-0.65,-2.3) 2(1.8,-2.3)
  rect 1.6x3.8 smd: 3(-6.2,3.9)
  rect 1.6x3 smd: 3(-6.2,-4.5)
  rect 1.6x1.8 smd: 3(6.2,5.025) 3(6.2,-5.025)
  rect 1.6x2.6 smd: 3(6.2,0)
CRYSTAL-SMD_4P-L2.0-W1.6-BL-2
  rect 1.1x0.8 smd: 1(-0.8,-0.575) 2(0.8,-0.575) 3(0.8,0.575) 4(-0.8,0.575)
FC-12M_L2.0-W1.2
  rect 0.925x1.3 smd: 1(-0.863,0) 2(0.863,0)
HDR-TH_4P-P2.54-V-F
  rect 1.7x1.7 hole 1.1: 1(-3.81,0)
  round 1.7 hole 1.1: 2(-1.27,0) 3(1.27,0) 4(3.81,0)
L0402
  rect 0.79x0.54 smd: 1(-0.545,0) 2(0.545,0)
L0603
  rect 0.8x0.864 smd: 1(-0.7,0) 2(0.7,0)
LED0603-R-RD_WHITE
  rect 0.8x0.8 smd: 1(0.8,0) 2(-0.8,0)
LED0603-RD-YELLOW
  rect 0.8x0.8 smd: 1(-0.799,-0.004) 2(0.799,0.004)
M2_KB
  round 2.1 hole 2.1: (0,0)
net-tie-2-0.3mm ft
  round 0.3 smd: 1(-0.4,0) 2(0.4,0)
PADPAD
  rect 2.5x2.5 smd: 1(0,-0.127)
R0402
  rect 0.566x0.54 smd: 1(-0.433,0) 2(0.433,0)
R0603
  rect 0.806x0.864 smd: 1(-0.753,0) 2(0.753,0)
SOD-123_L2.7-W1.6-LS3.7-RD-1
  rect 1.2x0.95 smd: 1(-1.7,0) 2(1.7,0)
SOD-523_L1.2-W0.8-LS1.6-FD
  rect 0.6x0.6 smd: 1(-0.8,0) 2(0.8,0)
SOT-23-6_L2.9-W1.6-P0.95-LS2.8-BR
  rect 1.1x0.6 smd: 1(1.35,-0.95) 2(1.35,0) 3(1.35,0.95) 4(-1.35,0.95) 5(-1.35,0) 6(-1.35,-0.95)
SW-SMD_4P-L5.1-W5.1-P3.70-LS6.5-TL_H1.5
  rect 1x0.75 smd: 1(-3,1.875) 2(3,1.875) 3(-3,-1.875) 4(3,-1.875)
UDFN-6_L1.2-W1.0-P0.40-BL
  rect 0.224x0.585 smd: 1(-0.4,-0.417) 2(0,-0.417) 3(0.4,-0.417) 4(0.4,0.417) 5(0,0.417) 6(-0.4,0.417)
USB-C_SMD-TYPE-C-31-M-12_1
  oval 1.2x2 hole 0.8x1.6: 1(4.325,1.706) 4(-4.325,1.706)
  oval 1.2x1.8 hole 0.8x1.4: 2(4.325,-2.474) 3(-4.325,-2.474)
  custom 0.6x1.3 smd: A1B12(-3.2,2.474) A4B9(-2.4,2.474) B1A12(3.2,2.474) B4A9(2.401,2.474)
  rect 0.3x1.3 smd: A5(-1.25,2.474) A6(-0.25,2.474) A7(0.25,2.474) A8(1.25,2.474) B5(1.75,2.474) B6(0.75,2.474) B7(-0.75,2.474) B8(-1.75,2.474)

## Nets
As in the schematic, except:
GND: C1.1 C3.1 C4.1 C5.1 C6.1 C7.1 C8.1 C9.1 C10.2 C11.1 C12.1 C13.1 C14.1 C15.2 C16.1 C17.1 C18.1 C19.1 C20.1 C21.1 C22.1 C23.1 C24.1 D83.1 H1.4 R3.1 R4.1 R5.1 R6.1 R7.1 R11.1 R12.1 SW1.3 SW1.4 U1.0 U1.B7 U2.2 U2.4 U3.5 U4.1 U6.1 USBC1.A1B12 USBC1.B1A12

Pads without a net: D83 2 3; K1 3; K2 3; K3 3; K4 3; K5 3; K6 3; K7 3; K8 3; K9 3; K10 3; K11 3; K12 3; K13 3; K14 3; K15 3; K16 3; K17 3; K18 3; K19 3; K20 3; K21 3; K22 3; K23 3; K24 3; K25 3; K26 3; K27 3; K28 3; K29 3; K30 3; K31 3; K32 3; K33 3; K34 3; K35 3; K36 3; K37 3; K38 3; K39 3; K40 3; K41 3; K42 3; K43 3; K44 3; K45 3; K46 3; K47 3; K48 3; K49 3; K50 3; K51 3; K52 3; K53 3; K54 3; K55 3; K56 3; K57 3; K58 3; K59 3; K60 3; K61 3; K62 3; K63 3; K64 3; K65 3; K66 3; K67 3; K68 3; K69 3; K70 3; K71 3; K72 3; K73 3; K74 3; K75 3; K76 3; K77 3; K78 3; U1 A18 AC15 AC17 AC19 B9 B11 B13 B15 B17 B19 G1 H2 J24 K2 L24 M2 P2 P23 R1 T2 T23 V23 Y23; USBC1 A8 B8
